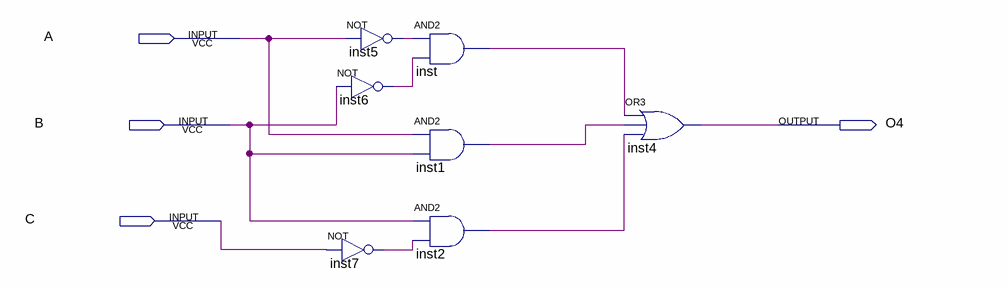
[diagram p0: schematic sheet]
// Quartus schematic F4.bdf as structural Verilog: 7 symbols, 4 pins
module F4 (
  input  A,
  input  B,
  input  C,
  output O4
);

  wire inst1_out, inst2_out, inst5_out, inst6_out, inst7_out, inst_out;

  not inst5 (inst5_out, A);
  not inst6 (inst6_out, B);
  not inst7 (inst7_out, C);
  and inst (inst_out, inst5_out, inst6_out);
  and inst1 (inst1_out, A, B);
  and inst2 (inst2_out, B, inst7_out);
  or inst4 (O4, inst_out, inst1_out, inst2_out);
endmodule
